# EAGLE design THAT4305_Comp_CE (EAGLE 9.6.2)
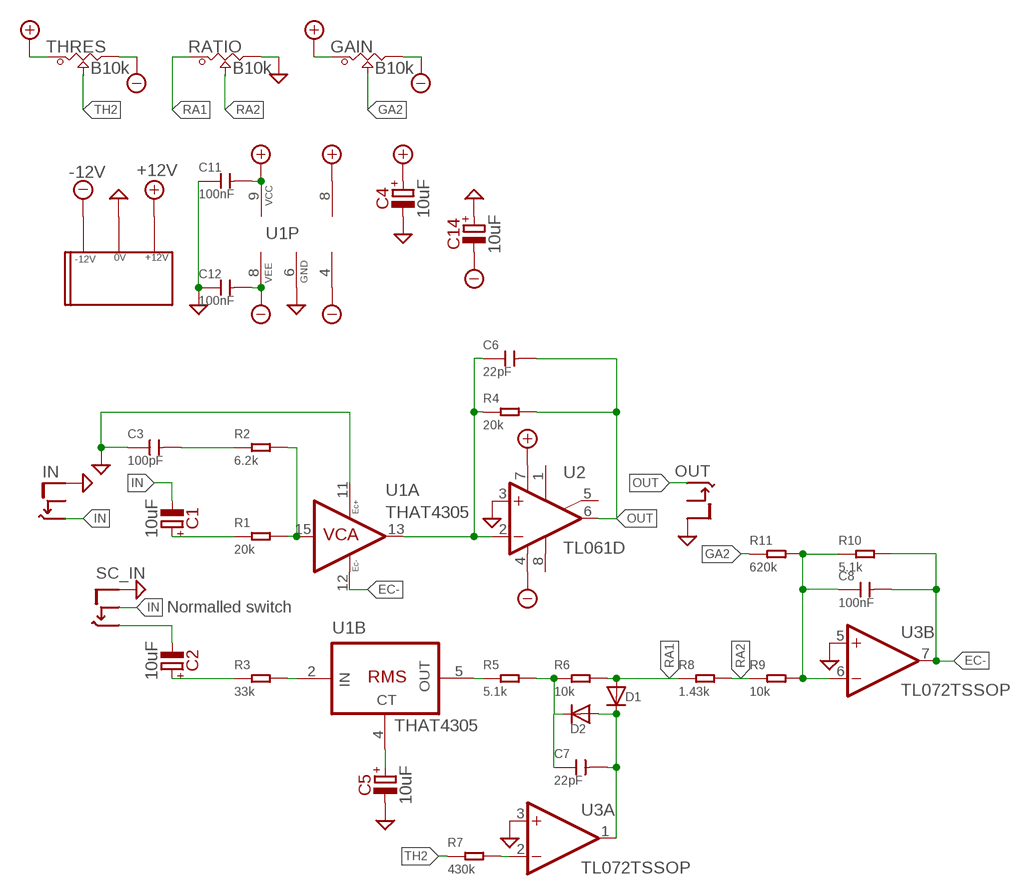
[diagram p0: schematic, sheet 1]

## Parts
C1  10uF  PAN_B  [PAN_B]
C2  10uF  PAN_B  [PAN_B]
C3  100pF  CERAMIC-1UF-25V-10%-X7R(0805)  [C0805]
C4  10uF  PAN_B  [PAN_B]
C5  10uF  PAN_B  [PAN_B]
C6  22pF  CERAMIC-1UF-25V-10%-X7R(0805)  [C0805]
C7  22pF  CERAMIC-1UF-25V-10%-X7R(0805)  [C0805]
C8  100nF  CERAMIC-1UF-25V-10%-X7R(0805)  [C0805]
C11  100nF  CERAMIC-1UF-25V-10%-X7R(0805)  [C0805]
C12  100nF  CERAMIC-1UF-25V-10%-X7R(0805)  [C0805]
C14  10uF  PAN_B  [PAN_B]
D1  DIODESOD-123  [SOD-123]
D2  DIODESOD-123  [SOD-123]
GAIN  B10k  POT_9MM_SMD  [POT_9MM_SMD]
R1  20k  SMD-RES-20K-5%-1/8W(0805)  [R0805]
R2  6.2k  SMD-RES-20K-5%-1/8W(0805)  [R0805]
R3  33k  SMD-RES-20K-5%-1/8W(0805)  [R0805]
R4  20k  SMD-RES-20K-5%-1/8W(0805)  [R0805]
R5  5.1k  SMD-RES-20K-5%-1/8W(0805)  [R0805]
R6  10k  SMD-RES-20K-5%-1/8W(0805)  [R0805]
R7  430k  SMD-RES-20K-5%-1/8W(0805)  [R0805]
R8  1.43k  SMD-RES-20K-5%-1/8W(0805)  [R0805]
R9  10k  SMD-RES-20K-5%-1/8W(0805)  [R0805]
R10  5.1k  SMD-RES-20K-5%-1/8W(0805)  [R0805]
R11  620k  SMD-RES-20K-5%-1/8W(0805)  [R0805]
RATIO  B10k  POT_9MM_SMD  [POT_9MM_SMD]
THRES  B10k  POT_9MM_SMD  [POT_9MM_SMD]
U1  THAT4305  THAT4305Q16-U  [QSOP16]
U2  TL061D  [SO08]
U3  TL072TSSOP  [TSSOP-8]
U$2  EURO_POW_CEH  [EURO_POW_CEH]
U$3  THONKICONN_CE_3X_COMG_1SW  [1.27MM_CE_4X_COMG_NOSW]

## Nets
+12V: C4.1+(+) C11.2 GAIN.1 THRES.1 U1.9(P:VCC) U2.7(V+) U3.8(P:V+) U$2.+12V
-12V: C12.2 C14.2-(-) GAIN.3 THRES.3 U1.8(P:VEE) U2.4(V-) U3.4(P:V-) U$2.-12V
EC-: C8.2 R10.2 U1.12(A:EC-) U3.7(B:OUT)
GA2: GAIN.2 R11.1
GND: C3.1 C4.2-(-) C5.2-(-) C11.1 C12.1 C14.1+(+) RATIO.3 U1.6(P:GND) U1.11(A:EC+) U2.3(+IN) U3.3(A:+IN) U3.5(B:+IN) U$2.GND U$3.0(S)
IN: C1.2-(-) U$3.2(SW) U$3.3(T)
N$1: C1.1+(+) R1.1
N$2: C3.2 R2.1
N$3: R1.2 R2.2 U1.15(A:VCA_IN)
N$4: C2.1+(+) R3.1
N$5: R3.2 U1.2(B:RMS_IN)
N$7: C5.1+(+) U1.4(B:CT)
N$9: C6.1 R4.1 U1.13(A:VCA_OUT) U2.2(-IN)
N$10: R5.1 U1.5(B:RMS_OUT)
N$11: C7.1 D2.C R5.2 R6.1
N$12: C8.1 R9.2 R10.1 R11.2 U3.6(B:-IN)
N$13: C7.2 D1.C D2.A U3.1(A:OUT)
N$14: R7.2 U3.2(A:-IN)
OUT: C6.2 R4.2 U2.6(OUT) U$3.4(T)
RA1: D1.A R6.2 R8.1 RATIO.1
RA2: R8.2 R9.1 RATIO.2
SC_IN: C2.2-(-) U$3.1(T)
TH2: R7.1 THRES.2
Unconnected: U2.1(ON1) U2.5(ON2) U2.8(OPT)

## Notes on the sheet
- OUT
- IN
- SC_IN
- Normalled switch

## Library data of the parts
C1 C2 C4 C5 C14 = Panasonic_ECap:PAN_B
C3 C6-C8 C11 C12 = OPL_Capacitor:CERAMIC-1UF-25V-10%-X7R(0805): 302010179; MPN: CC0805KKX7R8BB105; VALUE: 1uf
D1 D2 = adafruit:DIODE: Diode SMADIODE - SMA Surface Mount Package 20V 1A Schottky Diode Digikey: 641-1014-6-ND DO-1N4148 - Through Hole Small Current Diode SOD-123 20V 1 A (.5mV Vf) Schottky Diode - Digikey: MBRX120TPMSCT-ND SOD-323 10V 570mA (.38mV Vf, 3ns) Schottky Diode - Digikey: ZLLS410CT-ND SOD-523 30V 30mA Schottky Diode (RB751S-40TE61) - Digikey: RB751S-40TE61CT-ND SOT23-R/W - SOT23 Package (R = Solder Paste/Reflow Ovens, W = Hand-Soldering) BAT54Film 40V 300mA - Digikey: 497-7162-1-ND
GAIN RATIO THRES = Mech_BO_CE_SW:POT_9MM_SMD
R1-R11 = OPL_Resistor:SMD-RES-20K-5%-1/8W(0805): 301012190; MPN: RC0805JR-071KL; VALUE: 1K
U1 = that-corp:THAT4305: Pre-trimmed Analog Engine® IC
U2 = linear:TL061: OP AMP
U3 = MusicThingModular:TL072: Generic Dual Op Amp
U$2 = 2.54mm_PowHeader_SMD:EURO_POW_CEH: Eurorack Power Header Reduced Card Edge Surface Mount Pads
U$3 = THONKICONN_BE:THONKICONN_CE_3X_COMG_1SW

## Board
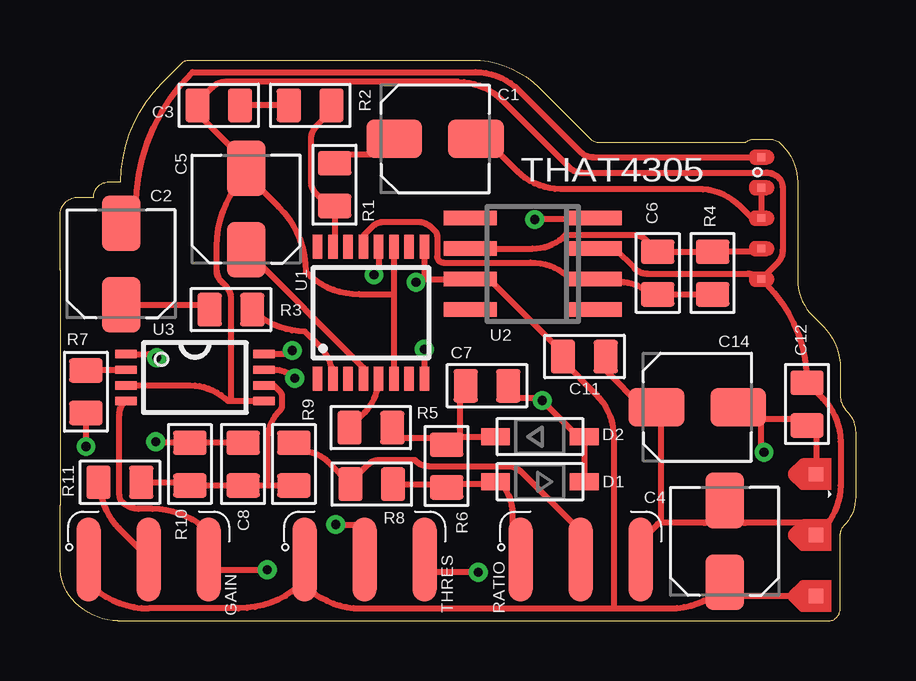
[diagram p1: board, top side]
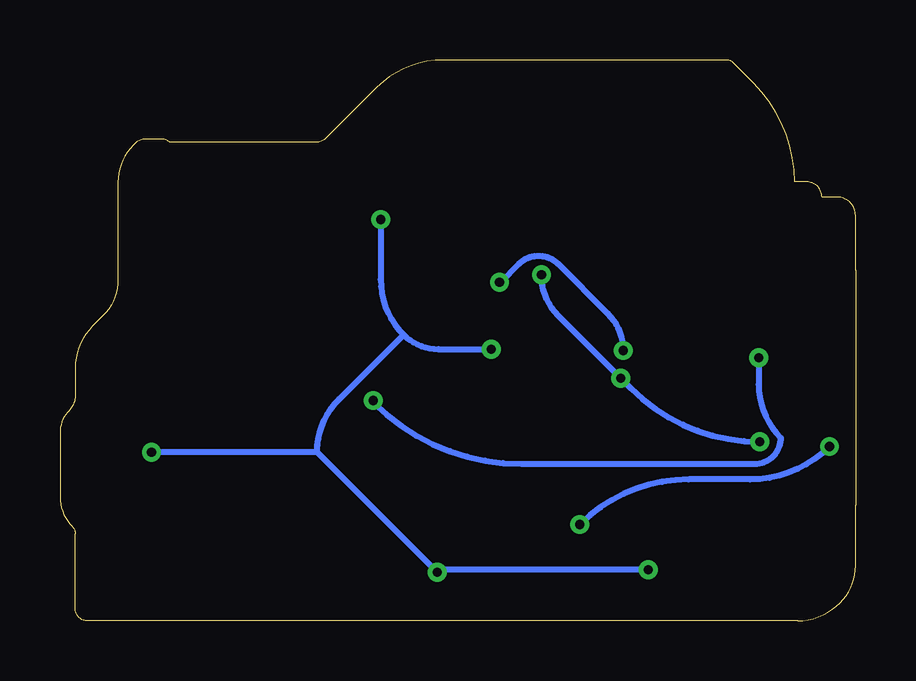
[diagram p2: board, bottom side, seen from below]

Size 33.15 x 23.37 mm. Coordinates in mm from the lower left corner, seen from the top.
Outline: 0,14.61 0,4.83 0,2.29 arc45 0.64,0.76 arc45 2.41,0 32,0 arc90 32.51,0.51 32.51,3.63 arc-45 32.64,3.94 arc45 33.15,5.16 33.15,7.84 arc45 32.77,8.76 arc-45 32.51,9.38 32.51,10.54 arc45 31.79,12.28 31.36,12.71 arc-45 30.73,14.22 30.73,18.28 arc45 30.1,19.81 30.02,19.89 arc45 29.59,20.07 28.88,20.07 arc45 28.57,19.94 22.48,19.94 arc-45 22.05,20.12 19.94,22.23 arc45 17.18,23.37 5.39,23.37 arc45 5.08,23.24 4.25,22.41 arc45 2.54,18.29 2.03,18.29 arc90 1.4,17.65 0.76,17.65 arc90 0,16.89 0,14.61
Copper layers (1*16): Top 0.035mm / dielectric 1.5mm / Bottom 0.035mm
Design rules "default *": minimum track width 6mil, minimum drill 0.35mm, track to track 6mil, track to pad 6mil, pad to pad 6mil, via to via 6mil, smd to smd 6mil, copper to edge 10mil, drill to drill 6mil, minimum pad ring 10mil, minimum via ring 8mil, stop-mask expansion 4mil, vias tented up to drill 0mil, thermal gap 10mil

### Footprints (pad centres in the part's own frame; a part is rotated, then mirrored left to right if it is on the bottom)
PAN_B = smd 2.312 x 1.6: 1+ -1.7,0; 2- 1.7,0
C0805 = smd 1.397 x 1.016: 1 0,0.889; 2 0,-0.889
SOD-123 = smd 1.2 x 0.7: A 1.85,0; C -1.85,0
POT_9MM_SMD = smd 0.991 x 3.505: 1 -2.5,0; 2 0,0; 3 2.5,0
R0805 = smd 1.397 x 1.016: 1 0,0.889; 2 0,-0.889
QSOP16 = smd 0.4 x 1: 1 -2.223,-2.75; 2 -1.588,-2.75; 3 -0.953,-2.75; 4 -0.318,-2.75; 5 0.318,-2.75; 6 0.953,-2.75; 7 1.588,-2.75; 8 2.223,-2.75; 9 2.223,2.75; 10 1.588,2.75; 11 0.953,2.75; 12 0.318,2.75; 13 -0.318,2.75; 14 -0.953,2.75; 15 -1.588,2.75; 16 -2.223,2.75
SO08 = smd 0.6 x 2.2: 1 -1.905,-2.6; 2 -0.635,-2.6; 3 0.635,-2.6; 4 1.905,-2.6; 5 1.905,2.6; 6 0.635,2.6; 7 -0.635,2.6; 8 -1.905,2.6
TSSOP-8 = smd 0.9 x 0.35: 1 -2.875,0.975; 2 -2.875,0.325; 3 -2.875,-0.325; 4 -2.875,-0.975; 5 2.875,-0.975; 6 2.875,-0.325; 7 2.875,0.325; 8 2.875,0.975
EURO_POW_CEH = smd 0.6 x 0.6: +12V 0,-3.175; -12V 5.08,-3.175; GND 2.54,-3.175
1.27MM_CE_4X_COMG_NOSW = smd 0.318 x 0.318: 0 5.08,0; 1 0,0; 2 1.27,0; 3 2.54,0; 4 3.81,0

### Placement (x,y rotation side)
C1  15.63,20.08 0 top
C2  2.55,14.87 90 top
C3  6.62,21.48 90 top
C4  27.7,3.31 90 top
C5  7.76,17.16 90 top
C6  24.9,14.49 180 top
C7  17.79,9.79 90 top
C8  7.63,6.53 180 top
C11  21.85,11.01 270 top
C12  31.13,9.03 0 top
C14  26.55,8.9 0 top
D1  20,5.79 180 top
D2  20,7.67 0 top
GAIN  3.69,2.55 0 top
R1  11.44,18.17 0 top
R2  10.43,21.48 90 top
R3  7.12,12.97 90 top
R4  27.19,14.49 180 top
R5  12.95,8.05 90 top
R6  16.11,6.45 0 top
R7  1.08,9.54 180 top
R8  12.99,5.7 270 top
R9  9.74,6.53 0 top
R10  5.41,6.53 180 top
R11  2.5,5.77 90 top
RATIO  21.69,2.55 0 top
THRES  12.69,2.55 0 top
U1  12.96,12.84 0 top
U2  19.7,14.87 90 top
U3  5.62,10.13 0 top
U$2  28.33,1.03 90 top
U$3  29.22,19.32 270 top

### Tracks (layer width: path | path; a pad name or v marks a point on that pad's centre or on a via)
+12V  (via drill 0.38)
  Top 0.254: U$2.+12V 28.28,1.03 27.8,1.51 | 27.8,1.51 C4.1+ | GAIN.1 1.19,1.56 arc45 3.69,0.52 7.44,0.52 arc45 10.19,1.66 THRES.1 10.19,1.48 arc45 12.52,0.52 23.07,0.52 | 23.07,0.52 25.41,0.52 arc45 27.8,1.51 | 23.07,0.52 23.07,7.65 arc45 22.33,9.45 20.96,10.81 C11.2 20.96,11.15 17.88,14.24 U2.7 15.24,14.24 | U3.8 9.28,11.11 arc45 9.65,11.26 v9.68,11.26 | v14.83,14.11 arc-45 15.13,14.24 15.24,14.24 | U1.9 15.18,14.38 arc45 15.24,14.24
  Bottom 0.254: v14.83,14.11 14.79,14.11 14.02,14.88 arc90 12.4,14.88 10.32,12.8 arc45 v9.68,11.26
-12V  (via drill 0.38)
  Top 0.254: 29.21,8.39 30.87,8.39 C12.2 31.51,7.76 U$2.-12V | 29.21,8.39 28.76,8.39 C14.2- | U3.4 2.69,9.11 arc45 2.47,8.57 2.47,5.23 arc45 2.58,4.96 arc45 3.28,4.67 3.85,4.67 arc-45 6.19,3.7 GAIN.3 6.62,2.12 v8.63,2.12 | v17.43,2.02 15.13,2.02 15.13,2.49 THRES.3 | 29.21,8.39 29.21,7.33 arc45 v29.33,7.02 | U2.4 22.24,16.72 v19.78,16.72 | v15.18,11.32 U1.8
  Bottom 0.254: v8.63,2.12 17.19,2.12 arc-45 v17.43,2.02 22.43,7.02 | 22.43,7.02 v29.33,7.02 | 18.83,11.92 arc-45 17.39,11.32 v15.18,11.32 | v19.78,16.72 19.78,14.22 arc-45 18.83,11.92 | 22.43,7.02 arc45 21.52,9.24 18.83,11.92
EC-  (via drill 0.38)
  Top 0.254: U3.7 8.95,10.46 arc-45 v9.78,10.11 | C8.2 R10.2 4.03,7.42 v3.98,7.46 | U1.12 13.28,14.6 v13.08,14.41
  Bottom 0.254: v3.98,7.46 arc45 9.36,9.69 v9.78,10.11 12.38,12.71 arc45 v13.08,14.41
GA2
  Top 0.254: R11.1 1.7,5.68 arc45 2.45,3.86 3.69,2.62 GAIN.2
GND
  Top 0.254: U2.3 23.12,15.51 23.94,14.69 arc45 24.48,14.47 28.67,14.47 arc-45 U$3.0 | 27.7,4.63 28.03,4.3 arc45 28.57,4.08 31,4.08 U$2.GND 31.78,3.84 arc45 32.52,5.64 32.52,7.47 arc45 31.78,9.27 C12.1 arc45 29.42,14.04 U$3.0 | C4.2- 27.7,4.63 | 27.7,4.63 27.36,4.3 arc-45 26.82,4.08 25.03,4.08 | 25.03,4.08 arc45 24.9,4.03 24.19,3.31 RATIO.3 | 25.03,4.08 25.03,8.73 C14.1+ 24.27,8.9 22.74,10.43 C11.1 | U$3.0 29.89,14.9 arc45 30.11,15.44 30.11,18.09 arc45 29.96,18.45 arc45 29.42,18.68 21.75,18.68 arc-45 21.21,18.9 18.4,21.71 arc45 16.61,22.45 6.89,22.45 arc45 6.35,22.23 5.73,21.61 C3.1 5.73,21.14 7.76,19.11 C5.2- 7.76,18.61 | U1.11 13.91,13.61 | 13.91,13.61 U1.6 | U3.3 5.43,9.81 arc-45 7,9.16 7.12,9.16 | 7.76,18.61 9.11,17.25 arc-45 10.24,14.54 arc45 12.47,13.61 13.91,13.61 | 7.12,9.16 7.12,13.41 arc45 6.9,13.95 6.75,14.1 arc-45 6.53,14.64 6.53,15.6 arc-45 7.76,18.57 7.76,18.61 | 7.12,9.16 U3.5
IN
  Top 0.254: C1.2- 17.71,20.08 19.06,18.73 arc45 20.85,17.99 26.57,17.99 arc-45 28.37,17.25 28.84,16.78 U$3.3 U$3.2
N$1
  Top 0.254: R1.1 11.82,19.44 13.3,19.44 C1.1+
N$2
  Top 0.254: R2.1 C3.2
N$3
  Top 0.254: U1.15 11.44,15.66 R1.2 11.19,17.29 10.69,17.79 arc-45 10.46,18.32 10.46,20.06 arc-45 10.69,20.6 11.31,21.23 R2.2
N$4
  Top 0.254: C2.1+ 6.03,13.17 R3.1
N$5
  Top 0.254: U1.2 arc45 10.8,11.47 10.21,12.05 arc-45 R3.2 | R3.2
N$7
  Top 0.254: U1.4 12.64,10.55 7.76,15.43 C5.1+
N$9
  Top 0.254: R4.1 C6.1 24.58,13.6 arc45 23.35,14.11 22.42,14.11 U2.2 21.28,14.24 arc45 19.61,14.93 15.97,14.93 arc-90 15.72,15.18 15.72,16.04 arc45 15.64,16.22 15.46,16.4 arc45 14.93,16.62 13.51,16.62 arc45 13.01,16.42 12.67,16.08 12.67,15.62 U1.13
N$10
  Top 0.254: R5.1 12.69,8.68 arc45 U1.5
N$11
  Top 0.254: R5.2 14.29,7.6 15.65,7.6 15.91,7.34 R6.1 16.36,7.34 16.65,7.63 | 16.65,7.63 16.7,7.67 D2.C | C7.1 16.65,9.54 16.65,7.63
N$12
  Top 0.254: R11.2 5.28,5.77 R10.1 C8.1 8.63,5.64 | 8.63,5.64 8.63,7.47 arc-45 9.18,8.78 arc45 9.25,8.96 9.25,9.36 arc45 9.18,9.54 8.9,9.81 U3.6 | 8.63,5.64 R9.2
N$13  (via drill 0.38)
  Top 0.254: D1.C D2.A 21.6,7.67 v20.09,9.18 19.99,9.28 19.06,9.28 18.68,9.66 C7.2 | U3.1 3.68,11.11 arc-45 v4.03,10.96
  Bottom 0.254: v4.03,10.96 4.03,9.86 arc-45 3.11,7.63 arc90 4.2,6.54 13.92,6.54 arc45 20.09,9.1 v20.09,9.18
N$14
  Top 0.254: R7.2 1.1,10.46 U3.2
OUT
  Top 0.254: U2.6 19.68,15.51 arc45 21.08,16.09 23.88,16.09 arc-45 24.42,15.86 C6.2 R4.2 29.09,15.38 U$3.4
RA1
  Top 0.254: R8.1 15.97,5.7 R6.2 16.23,5.69 18.04,5.69 D1.A 18.3,5.79 arc-45 18.85,4.47 18.85,3.9 19.19,3.55 RATIO.1
RA2
  Top 0.254: R9.1 10.1,7.07 arc-45 11.17,6.62 R8.2 12.1,5.78 12.79,6.48 arc-45 13.33,6.7 14.75,6.7 arc-45 14.81,6.67 arc45 15.35,6.45 18.66,6.45 arc-45 19.2,6.23 21.69,3.73 RATIO.2
SC_IN
  Top 0.254: C2.2- 3.16,17.18 arc-45 5.51,22.86 17.31,22.86 arc-45 19.11,22.12 21.68,19.54 arc45 22.22,19.32 U$3.1
TH2  (via drill 0.38)
  Top 0.254: R7.1 v1.08,7.27 v1.08,7.26 | v11.48,4.01 12.53,4.01 12.69,3.85 THRES.2
  Bottom 0.254: v1.08,7.26 arc45 4.4,5.89 6.95,5.89 arc-45 v11.48,4.01

### Text on the board
tPlace: THAT4305